# EAGLE design osborne1 (EAGLE 9.6.2)
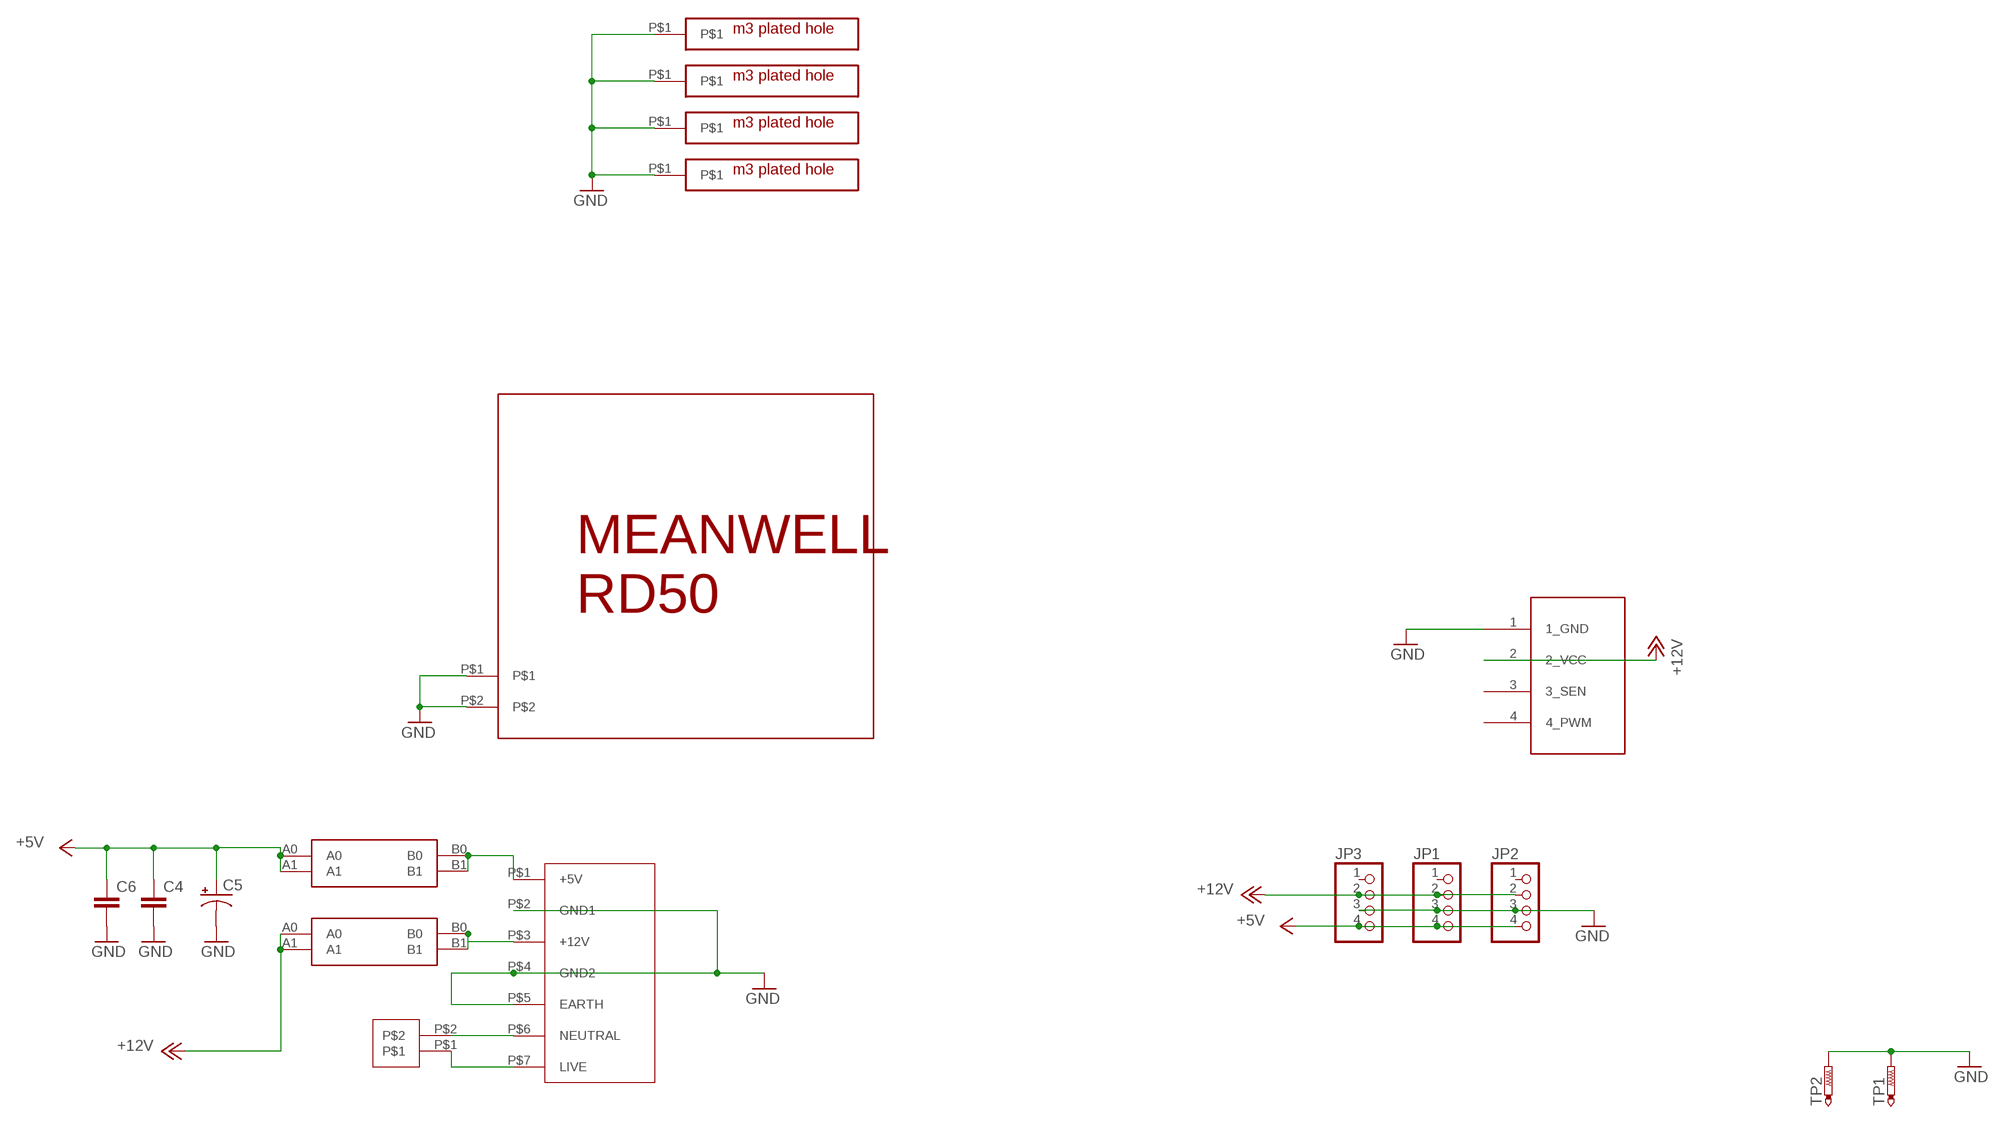
[diagram p0: schematic, sheet 1]

## Parts
C4  C5/2.5  [C5B2.5]
C5  CPOL-USE3.5-8  [E3,5-8]
C6  C5/2.5  [C5B2.5]
JP1  PINHD-1X4/90  [1X04/90]
JP2  PINHD-1X4/90  [1X04/90]
JP3  PINHD-1X4/90  [1X04/90]
JP4  4PIN_FAN  [1X04]
TP1  PTR1PAD1-17  [P1-17]
TP2  PTR1PAD1-17  [P1-17]
U$1  MEANWELL_RD50  [MEANWELL_RD50]
U$2  396_2P_LIVE  [396_2P_LIVE]
U$3  TERM_RD50_MAINS  [TERMINAL9500_MAINS]
U$4  M3_HOLE_PLATED  [M3_HOLE_PLATED]
U$5  M3_HOLE_PLATED  [M3_HOLE_PLATED]
U$6  M3_HOLE_PLATED  [M3_HOLE_PLATED]
U$7  CAR_FUSE_HOLDER3IN1  [FUSE_HOLDER_3IN1]
U$8  M3_HOLE_PLATED  [M3_HOLE_PLATED]
U$9  CAR_FUSE_HOLDER3IN1  [FUSE_HOLDER_3IN1]

## Nets
+5V: C4.1 C5.+ C6.1 JP1.4 JP2.4 JP3.4 U$9.A0 U$9.A1
+12V: JP1.2 JP2.2 JP3.2 JP4.2(2_VCC) U$7.A0 U$7.A1
GND: C4.2 C5.- C6.2 JP1.3 JP2.3 JP3.3 JP4.1(1_GND) TP1.TP TP2.TP U$1.P$1 U$1.P$2 U$3.P$2(GND1) U$3.P$4(GND2) U$3.P$5(EARTH) U$4.P$1 U$5.P$1 U$6.P$1 U$8.P$1
N$1: U$3.P$3(+12V) U$7.B0 U$7.B1
N$2: U$3.P$1(+5V) U$9.B0 U$9.B1
N$3: U$2.P$2 U$3.P$6(NEUTRAL)
N$4: U$2.P$1 U$3.P$7(LIVE)
Unconnected: JP1.1 JP2.1 JP3.1 JP4.3(3_SEN) JP4.4(4_PWM)

## Library data of the parts
C4 C6 = capacitor-wima:C: CAPACITOR naming: grid - package width
C5 = adafruit_changed:CPOL-US: POLARIZED CAPACITOR, American symbol
JP1-JP3 = pinhead:PINHD-1X4: PIN HEADER
JP4 = appleii:4PIN_FAN: PIN HEADER
TP1 TP2 = testpad:PTR1: TEST PIN
U$1 = os1:MEANWELL_RD50
U$2 = 396_conn:396_2P_LIVE
U$3 = os1:TERM_RD50_MAINS
U$4-U$6 U$8 = os1:M3_HOLE_PLATED
U$7 U$9 = atx_power_control:CAR_FUSE_HOLDER

## Board
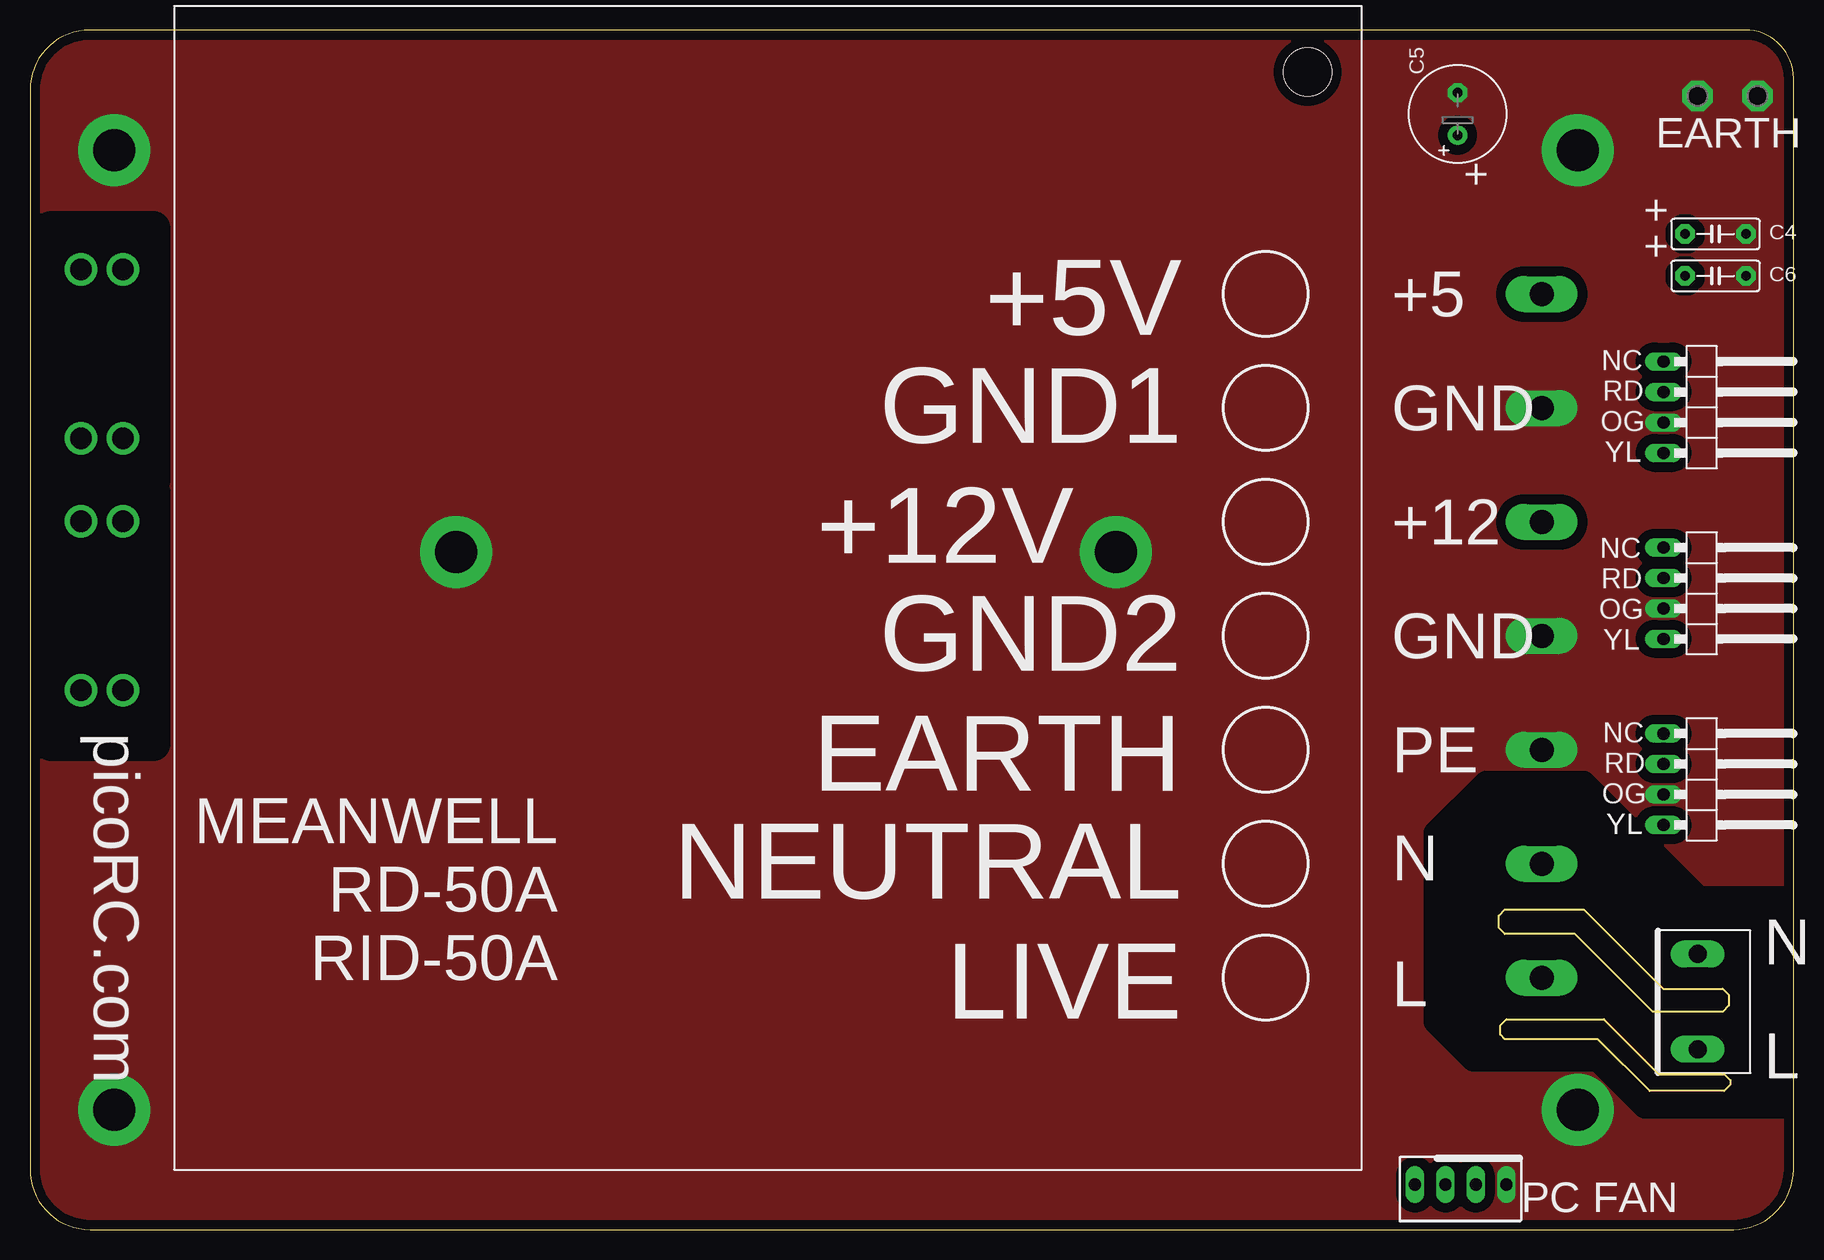
[diagram p1: board, top side]
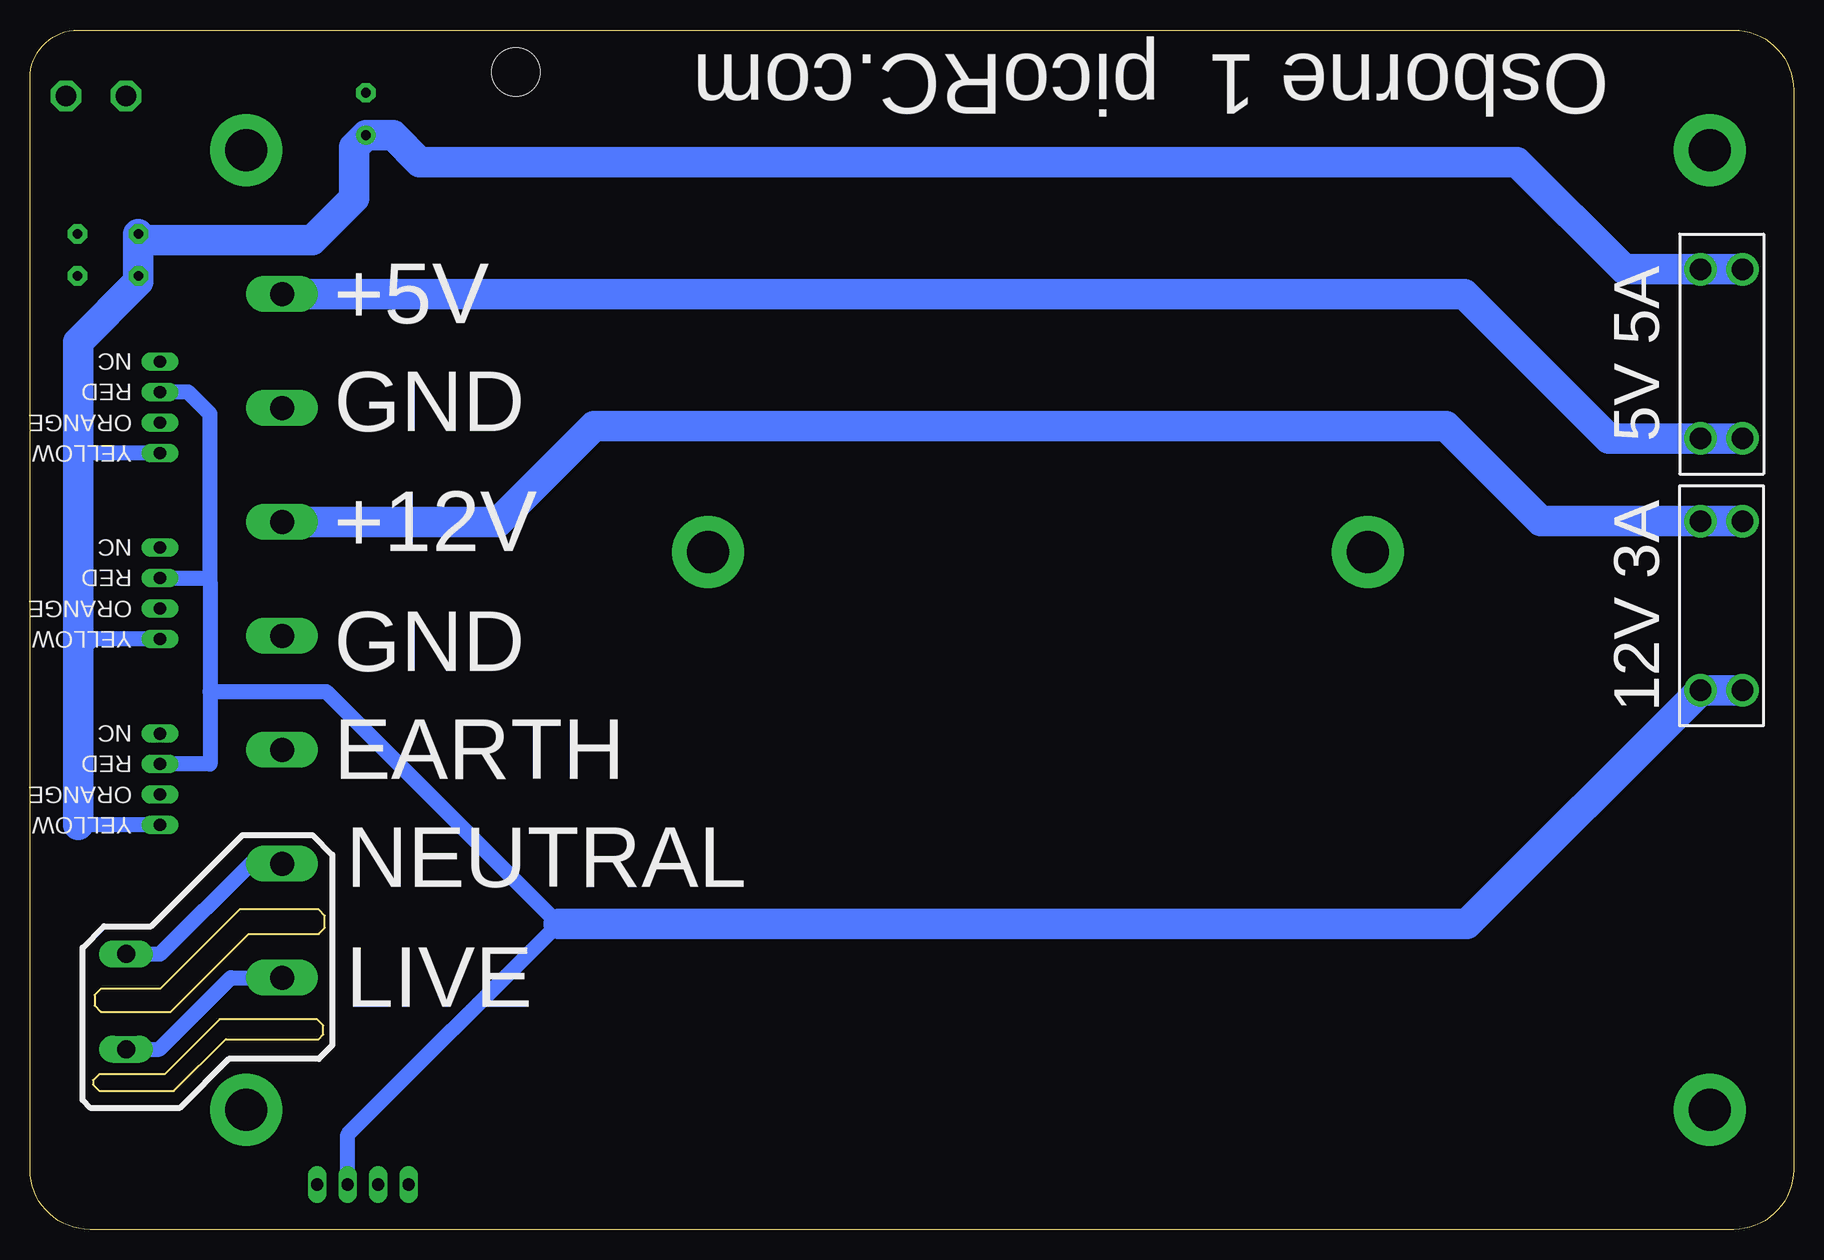
[diagram p2: board, bottom side, seen from below]

Size 147 x 100 mm. Coordinates in mm from the lower left corner, seen from the top.
Outline: 5,0 142,0 arc90 147,5 147,96 arc90 143,100 5,100 arc90 0,95 0,5 arc90 5,0
Copper layers (1*16): Top 0.035mm / dielectric 1.5mm / Bottom 0.035mm
Design rules "deku_2layer_6mil *": minimum track width 6mil, minimum drill 15mil, track to track 20mil, track to pad 6mil, pad to pad 6mil, via to via 6mil, smd to smd 6mil, copper to edge 10mil, drill to drill 6mil, minimum pad ring 7mil, minimum via ring 7mil, stop-mask expansion 4mil, vias tented up to drill 25mil, thermal gap 10mil
tRestrict: area 1.8,62.5 to 10.2,83.5; area 1.8,40.5 to 10.2,61.5; area 117.1,10.2 to 151.8,37.4
Milling: area 122.4,18.2 to 141.6,26.7; area 122.6,11.6 to 141.7,17.5

### Footprints (pad centres in the part's own frame; a part is rotated, then mirrored left to right if it is on the bottom)
C5B2.5 = drill 0.813 pad 1.6 octagon: 1 -2.54,0; 2 2.54,0
E3,5-8 = drill 0.813 pad 1.6: + -1.778,0 | drill 0.813 pad 1.6 octagon: - 1.778,0
1X04/90 = drill 1.016 long: 1 -3.81,-3.81; 2 -1.27,-3.81; 3 1.27,-3.81; 4 3.81,-3.81
1X04 = drill 1.016 long: 1 -3.81,0; 2 -1.27,0; 3 1.27,0; 4 3.81,0
P1-17 = drill 1.702 pad 2.54 octagon: TP 0,0
MEANWELL_RD50 = drill 3.5 pad 6: P$1 20.5,45.5; P$2 75.5,45.5 | hole 4: 4.5,5.5
396_2P_LIVE = drill 1.5 long: P$1 -3.96,0; P$2 3.96,0
TERMINAL9500_MAINS = drill 2 long: P$1 0,0; P$2 9.5,0; P$3 19,0; P$4 28.5,0; P$5 38,0; P$6 47.5,0; P$7 57,0
M3_HOLE_PLATED = drill 3.5 pad 6: P$1 0,0
FUSE_HOLDER_3IN1 = drill 1.8: A0 -7.05,1.75; A1 -7.05,-1.75; B0 7.05,1.75; B1 7.05,-1.75

### Placement (x,y rotation side)
C4  140.5,83 0 top
C5  119,93 90 top
C6  140.5,79.5 0 top
JP1  139.97,68.55 270 top
JP2  139.97,37.53 270 top
JP3  139.97,53.04 270 top
JP4  119.25,3.75 180 top
TP1  139,94.5 90 top
TP2  144,94.5 90 top
U$1  111,102 180 top
U$2  139,19 90 top
U$3  126,78 270 top
U$4  7,10 0 top
U$5  129,10 0 top
U$6  7,90 0 top
U$7  6,52 90 bottom
U$8  129,90 0 top
U$9  6,73 270 bottom

### Tracks (layer width: path | path; a pad name or v marks a point on that pad's centre or on a via)
+5V
  Bottom 1.27: JP2.4 143,33.72 | JP3.4 141.77,49.23 143,48 | JP1.4 142.74,64.74 143,65
  Bottom 2.54: U$9.A0 U$9.A1 14.12,80.05 23.07,89 114.51,89 116.74,91.22 C5.+ 120,90.22 120,85.98 123.49,82.49 137.45,82.49 C4.1 C6.1 137.96,79.04 143,74 143,65 143,48 143,33.72
+12V
  Bottom 1.27: 132,54 132,68 133.82,69.82 JP1.2 | JP3.2 132.31,54.31 132,54 | JP4.2 120.52,7.92 102.95,25.49 122.29,44.83 132,44.83 | 132,54 132,44.83 | 132,44.83 132,38.8 JP2.2
  Bottom 2.54: U$7.A1 U$7.A0 27.21,25.49 102.95,25.49
GND
  pour Top (isolate 0.813, no thermals): -11.5,116 -11.5,-11 185,-11 185,116
N$1
  Bottom 2.54: U$7.B1 U$7.B0 21.05,59.05 29,67 100,67 108,59 U$3.P$3
N$2
  Bottom 2.54: U$9.B0 U$9.B1 15.39,65.95 27.44,78 U$3.P$1
N$3
  Bottom 1.27: U$2.P$2 136.15,22.96 128.61,30.5 U$3.P$6
N$4
  Bottom 1.27: U$2.P$1 136.22,15.04 130.26,21 U$3.P$7

### Text on the board
tNames: EARTH | + | + | + | +5 | NC | RD | GND | OG | YL | +12 | NC | RD | OG | GND | YL | NC | PE | RD | OG | YL | N | picoRC.com | N | L | L | PC FAN
bNames: Osborne 1 picoRC.com | +5V | 5V 5A | GND | YELLOW / ORANGE / RED / NC | +12V | YELLOW / ORANGE / RED / NC | 12V 3A | GND | EARTH | YELLOW / ORANGE / RED / NC | NEUTRAL | LIVE